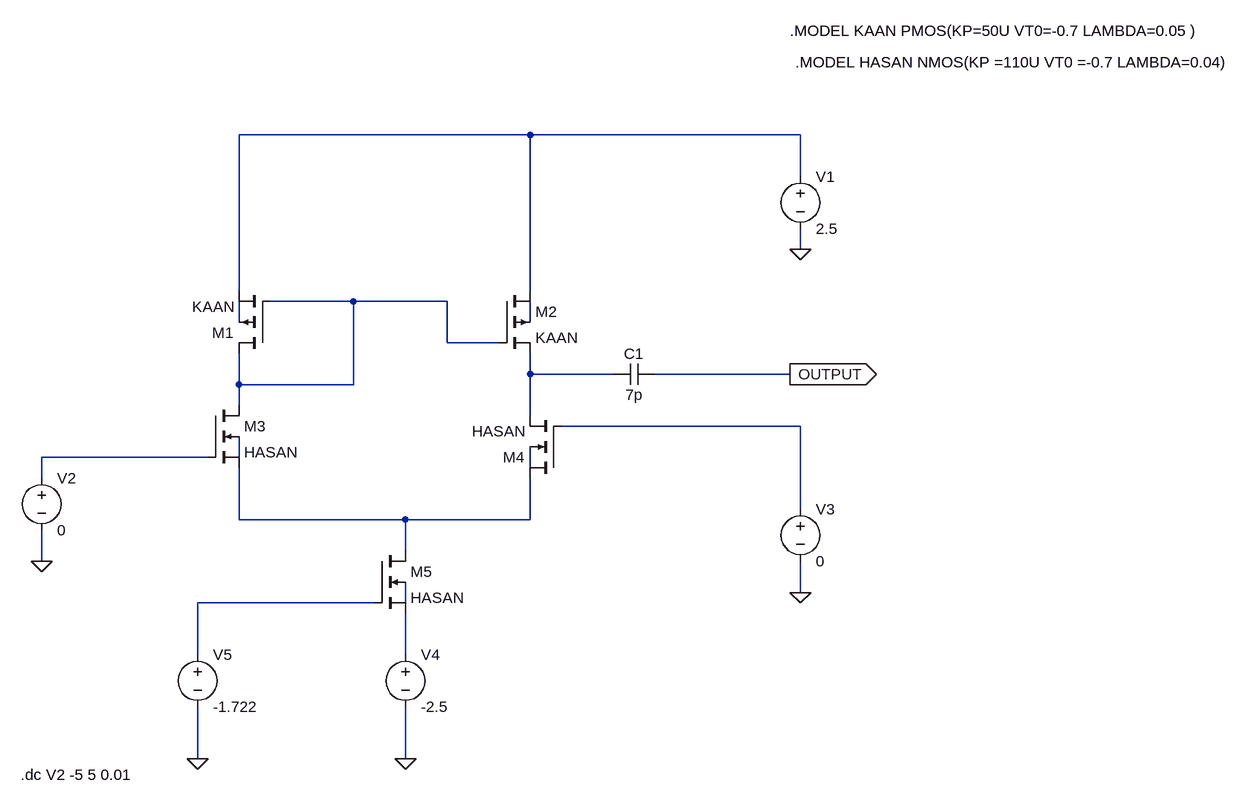
[diagram p0: schematic DC_Sweep_analizi.asc]
DC_Sweep_analizi.asc, the LTspice schematic file:
Version 4
SHEET 1 1696 840
WIRE 592 -160 144 -160
WIRE 1008 -160 592 -160
WIRE 1008 -96 1008 -160
WIRE 1008 16 1008 -16
WIRE 144 80 144 -160
WIRE 592 80 592 -160
WIRE 320 96 192 96
WIRE 464 96 320 96
WIRE 144 128 144 96
WIRE 592 128 592 96
WIRE 464 160 464 96
WIRE 544 160 464 160
WIRE 592 208 592 176
WIRE 720 208 592 208
WIRE 992 208 784 208
WIRE 144 224 144 176
WIRE 320 224 320 96
WIRE 320 224 144 224
WIRE 144 256 144 224
WIRE 592 272 592 208
WIRE 1008 288 640 288
WIRE 96 336 -160 336
WIRE 144 336 144 304
WIRE 592 352 592 320
WIRE -160 368 -160 336
WIRE 1008 416 1008 288
WIRE 144 432 144 352
WIRE 400 432 144 432
WIRE 592 432 592 368
WIRE 592 432 400 432
WIRE 400 480 400 432
WIRE -160 496 -160 448
WIRE 1008 544 1008 496
WIRE 352 560 80 560
WIRE 400 560 400 528
WIRE 80 640 80 560
WIRE 400 640 400 576
WIRE 80 800 80 720
WIRE 400 800 400 720
FLAG 400 800 0
FLAG 80 800 0
FLAG -160 496 0
FLAG 1008 544 0
FLAG 1008 16 0
FLAG 992 208 OUTPUT
IOPIN 992 208 Out
SYMBOL pmos4 192 176 R180
SYMATTR InstName M1
SYMATTR Value KAAN
SYMATTR Value2 l=10u w=120u
SYMBOL pmos4 544 80 R0
SYMATTR InstName M2
SYMATTR Value KAAN
SYMATTR Value2 l=10u w=120u
SYMBOL nmos4 96 256 R0
SYMATTR InstName M3
SYMATTR Value HASAN
SYMATTR Value2 l=10u w=276u
SYMBOL nmos4 640 368 R180
SYMATTR InstName M4
SYMATTR Value HASAN
SYMATTR Value2 l=10u w=276u
SYMBOL nmos4 352 480 R0
SYMATTR InstName M5
SYMATTR Value HASAN
SYMATTR Value2 l=10u w=4482u
SYMBOL voltage 1008 -112 R0
WINDOW 123 0 0 Left 0
WINDOW 39 0 0 Left 0
SYMATTR InstName V1
SYMATTR Value 2.5
SYMBOL voltage -160 352 R0
WINDOW 123 0 0 Left 0
WINDOW 39 0 0 Left 0
SYMATTR InstName V2
SYMATTR Value 0
SYMBOL voltage 1008 400 R0
WINDOW 123 0 0 Left 0
WINDOW 39 0 0 Left 0
SYMATTR InstName V3
SYMATTR Value 0
SYMBOL voltage 400 624 R0
WINDOW 123 0 0 Left 0
WINDOW 39 0 0 Left 0
SYMATTR InstName V4
SYMATTR Value -2.5
SYMBOL voltage 80 624 R0
WINDOW 123 0 0 Left 0
WINDOW 39 0 0 Left 0
SYMATTR InstName V5
SYMATTR Value -1.722
SYMBOL cap 784 192 R90
WINDOW 0 0 32 VBottom 2
WINDOW 3 32 32 VTop 2
SYMATTR InstName C1
SYMATTR Value 7p
TEXT 992 -320 Left 2 !.MODEL KAAN PMOS(KP=50U VT0=-0.7 LAMBDA=0.05 )
TEXT 1000 -272 Left 2 !.MODEL HASAN NMOS(KP =110U VT0 =-0.7 LAMBDA=0.04)
TEXT -192 824 Left 2 !.dc V2 -5 5 0.01

The netlist it stands for:
* DC_Sweep_analizi.asc
M1 N002 N002 N001 N003 KAAN l=10u w=120u
M2 N001 N002 N005 N004 KAAN l=10u w=120u
M3 N002 N007 N010 N008 HASAN l=10u w=276u
M4 N010 N006 N005 N009 HASAN l=10u w=276u
M5 N010 N011 N013 N012 HASAN l=10u w=4482u
V1 N001 0 2.5
V2 N007 0 0
V3 N006 0 0
V4 N013 0 -2.5
V5 N011 0 -1.722
C1 OUTPUT N005 7p
.model NMOS NMOS
.model PMOS PMOS
.lib standard.mos
.MODEL KAAN PMOS(KP=50U VT0=-0.7 LAMBDA=0.05 )
.MODEL HASAN NMOS(KP =110U VT0 =-0.7 LAMBDA=0.04)
.dc V2 -5 5 0.01
.backanno
.end